# EAGLE design Metro Mini 328 V2 - STEMMA QT (EAGLE 9.6.2)
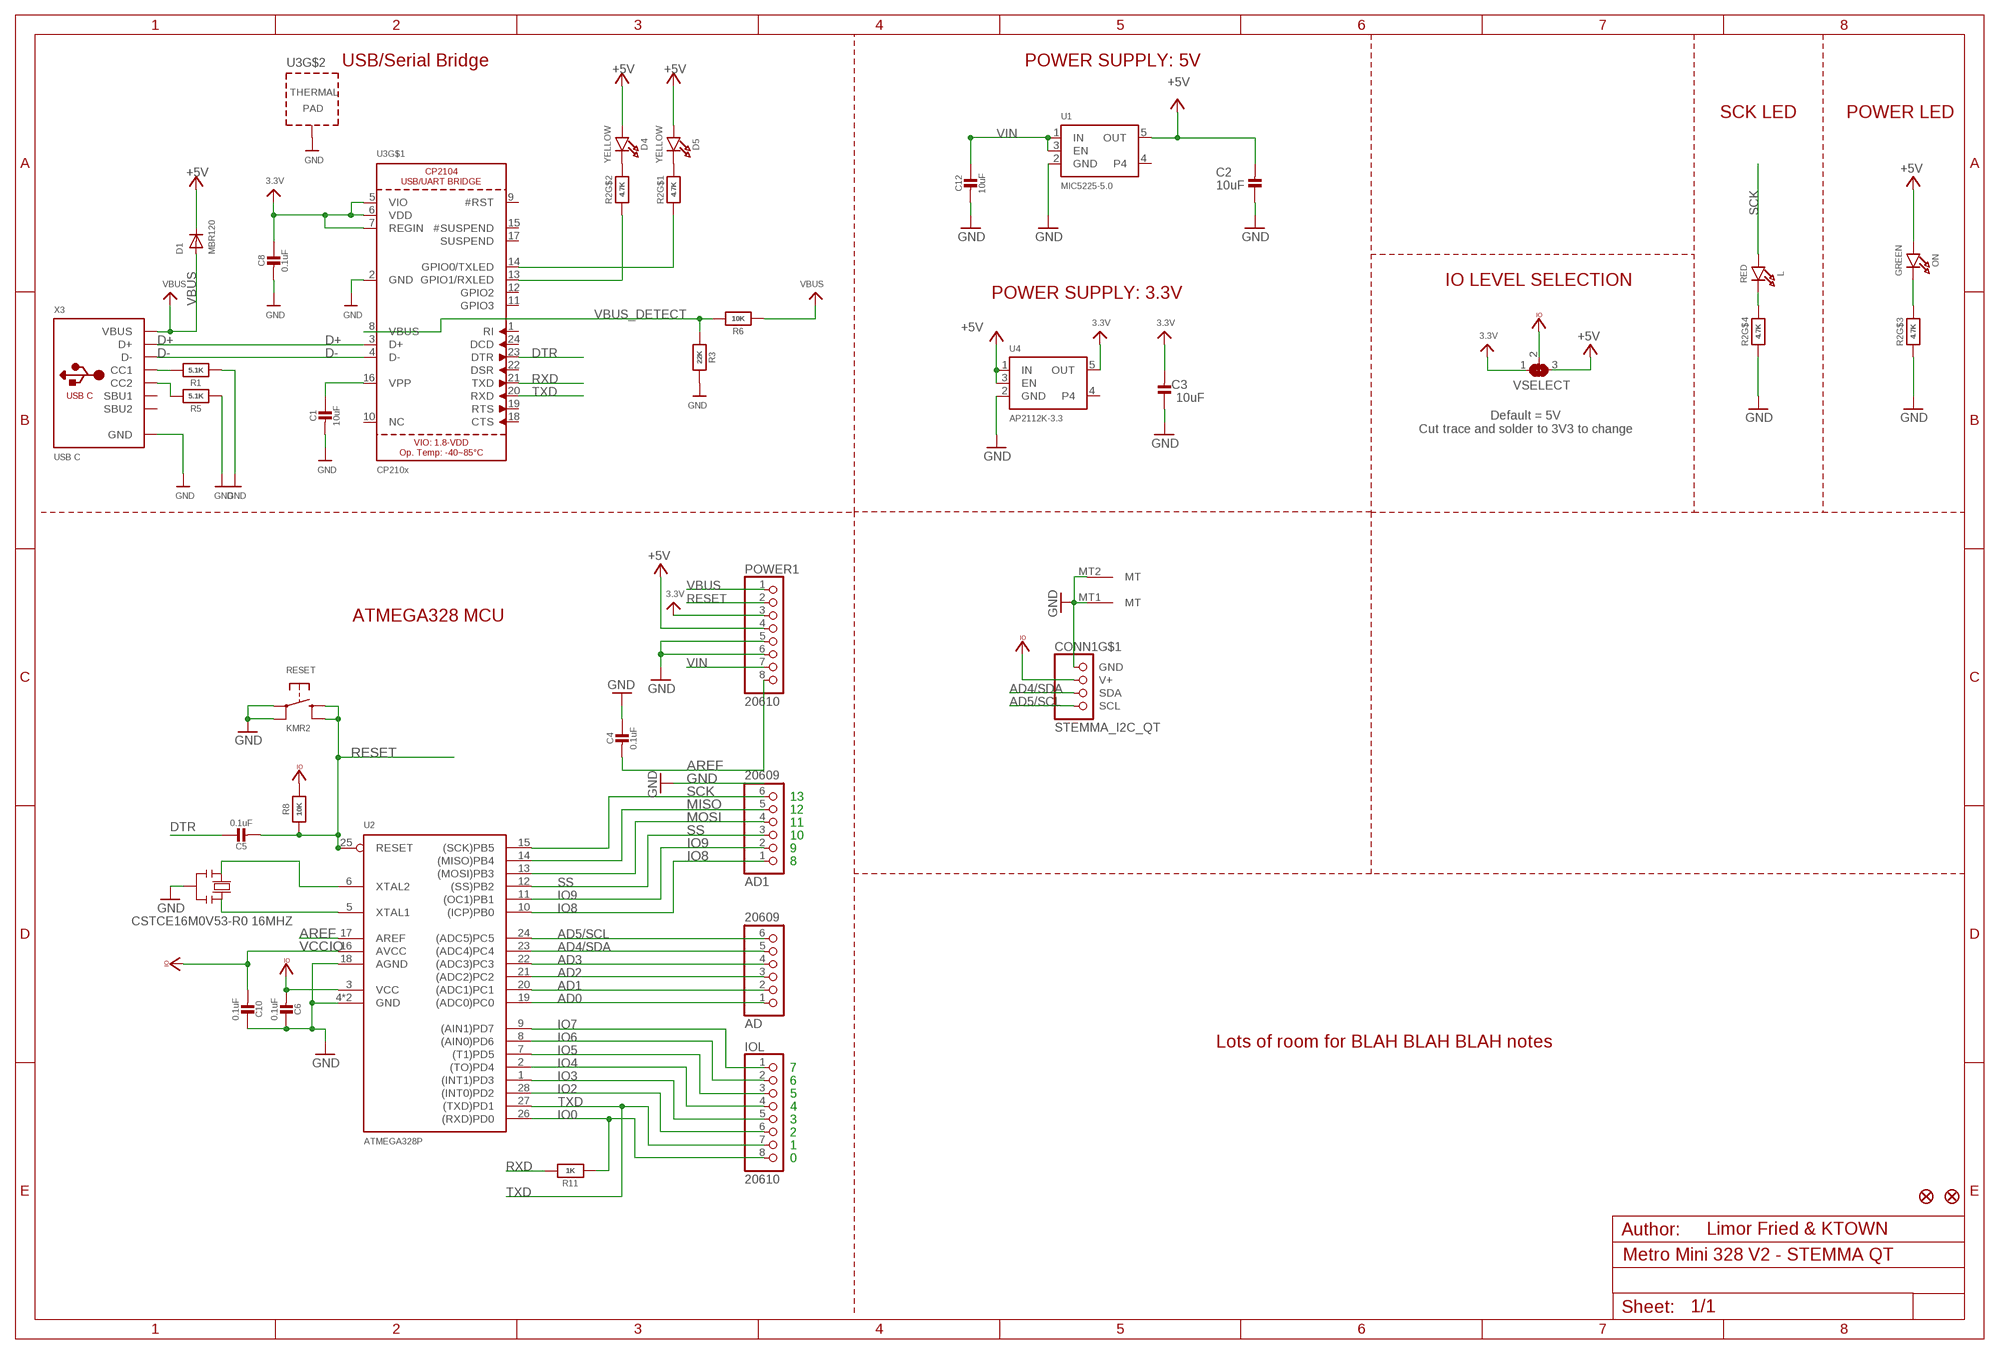
[diagram p0: schematic, sheet 1]

## Parts
AD  20609  HEADER-1X6ROUND  [1X06_ROUND]
AD1  20609  HEADER-1X6ROUND  [1X06_ROUND]
C1  10uF  CAP_CERAMIC0805-NOOUTLINE  [0805-NO]
C2  10uF  CAP_CERAMIC0805-NOOUTLINE  [0805-NO]
C3  10uF  CAP_CERAMIC0805-NOOUTLINE  [0805-NO]
C4  0.1uF  CAP_CERAMIC0603_NO  [0603-NO]
C5  0.1uF  CAP_CERAMIC0603_NO  [0603-NO]
C6  0.1uF  CAP_CERAMIC0603_NO  [0603-NO]
C8  0.1uF  CAP_CERAMIC0603_NO  [0603-NO]
C10  0.1uF  CAP_CERAMIC0603_NO  [0603-NO]
C12  10uF  CAP_CERAMIC0805-NOOUTLINE  [0805-NO]
CONN1  STEMMA_I2C_QT  [JST_SH4]
D1  MBR120  DIODE_MINISOD123  [SOD-123FL]
D4  YELLOW  LED0603_NOOUTLINE  [CHIPLED_0603_NOOUTLINE]
D5  YELLOW  LED0603_NOOUTLINE  [CHIPLED_0603_NOOUTLINE]
FD1  FIDUCIAL_1MM  [FIDUCIAL_1MM]
FD2  FIDUCIAL_1MM  [FIDUCIAL_1MM]
IOL  20610  HEADER-1X8ROUND  [1X08_ROUND]
L  RED  LED0603_NOOUTLINE  [CHIPLED_0603_NOOUTLINE]
ON  GREEN  LED0603_NOOUTLINE  [CHIPLED_0603_NOOUTLINE]
POWER1  20610  HEADER-1X870MIL  [1X08_ROUND_70]
R1  5.1K  RESISTOR_0603_NOOUT  [0603-NO]
R2  4.7K  RESISTOR_4PACK  [RESPACK_4X0603]
R3  22K  RESISTOR_0603_NOOUT  [0603-NO]
R5  5.1K  RESISTOR_0603_NOOUT  [0603-NO]
R6  10K  RESISTOR_0603_NOOUT  [0603-NO]
R8  10K  RESISTOR_0603_NOOUT  [0603-NO]
R11  1K  RESISTOR_0603_NOOUT  [0603-NO]
RESET  KMR2  SWITCH_TACT_SMT4.6X2.8  [BTN_KMR2_4.6X2.8]
U1  MIC5225-5.0  VREG_SOT23-5  [SOT23-5]
U2  ATMEGA328P  ATMEGA328P-MM  [QFN28_4MM_.45MM]
U3  CP210x  CP2104  [QFN24_4MM_SMSC]
U4  AP2112K-3.3  VREG_SOT23-5  [SOT23-5]
VSELECT  SOLDERJUMPER_2WAY  [SOLDERJUMPER_2WAY_OPEN_NOPASTE]
X3  USB C  USB_C  [USB_C_CUSB31-CFM2AX-01-X]
Y2  CSTCE16M0V53-R0 16MHZ  RESONATORMU  [RESONATOR]

## Nets
3.3V [power]: C3.2 C8.1 POWER1.3 U3.5(VIO) U3.6(VDD) U3.7(REGIN) U4.5(OUT) VSELECT.1
+5V [power]: C2.2 D1.C D4.A D5.A ON.A POWER1.4 U1.5(OUT) U4.1(IN) U4.3(EN) VSELECT.3
AD0: AD.1 U2.19((ADC0)PC0)
AD1: AD.2 U2.20((ADC1)PC1)
AD2: AD.3 U2.21((ADC2)PC2)
AD3: AD.4 U2.22((ADC3)PC3)
AD4/SDA: AD.5 CONN1.3(SDA) U2.23((ADC4)PC4)
AD5/SCL: AD.6 CONN1.4(SCL) U2.24((ADC5)PC5)
AREF: C4.2 POWER1.8 U2.17(AREF)
D+: U3.3(D+) X3.A6(D+) X3.B6(D+)
D-: U3.4(D-) X3.A7(D-) X3.B7(D-)
DTR: C5.1 U3.23(DTR)
GND [power]: C1.2 C2.1 C3.1 C4.1 C6.1 C8.2 C10.1 C12.2 CONN1.1(GND) CONN1.MT1(MT) CONN1.MT2(MT) POWER1.5 POWER1.6 R1.1 R2.3 R2.4 R3.1 R5.1 RESET.A'(P1) RESET.A(P) U1.2(GND) U2.4(GND) U2.18(AGND) U2.29(GND) U3.2(GND) U3.THERM(TP) U4.2(GND) X3.A1B12(GND) X3.B1A12(GND) Y2.2
IO0: IOL.8 R11.1 U2.26((RXD)PD0)
IO2: IOL.6 U2.28((INT0)PD2)
IO3: IOL.5 U2.1((INT1)PD3)
IO4: IOL.4 U2.2((TO)PD4)
IO5: IOL.3 U2.7((T1)PD5)
IO6: IOL.2 U2.8((AIN0)PD6)
IO7: IOL.1 U2.9((AIN1)PD7)
IO8: AD1.1 U2.10((ICP)PB0)
IO9: AD1.2 U2.11((OC1)PB1)
MISO: AD1.5 U2.14((MISO)PB4)
MOSI: AD1.4 U2.13((MOSI)PB3)
N$1: L.C R2.5
N$3: ON.C R2.6
N$4: R2.1 U3.14(GPIO0/TXLED)
N$5: R1.2 X3.A5(CC1)
N$6: D4.C R2.7
N$7: D5.C R2.8
N$9: R5.2 X3.B5(CC2)
N$12: C1.1 U3.16(VPP)
N$15: R2.2 U3.13(GPIO1/RXLED)
RESET: C5.2 POWER1.2 R8.1 RESET.B'(S1) RESET.B(S) U2.25(RESET)
RXD: R11.2 U3.21(TXD)
SCK: AD1.6 L.A U2.15((SCK)PB5)
SS: AD1.3 U2.12((SS)PB2)
TXD: IOL.7 U2.27((TXD)PD1) U3.20(RXD)
VBUS [power]: D1.A POWER1.1 R6.2 X3.A4B9(VBUS) X3.B4A9(VBUS)
VBUS_DETECT: R3.2 R6.1 U3.8(VBUS)
VCCIO: C6.2 C10.2 CONN1.2(V+) R8.2 U2.3(VCC) U2.16(AVCC) VSELECT.2
VIN [power]: C12.1 POWER1.7 U1.1(IN) U1.3(EN)
XTAL1: U2.5(XTAL1) Y2.3
XTAL2: U2.6(XTAL2) Y2.1
Unconnected: U1.4 U3.1(RI) U3.9(#RST) U3.10(NC) U3.11(GPIO3) U3.12(GPIO2) U3.15(#SUSPEND) U3.17(SUSPEND) U3.18(CTS) U3.19(RTS) U3.22(DSR) U3.24(DCD) U4.4 X3.A8(SBU1) X3.B8(SBU2)

## Notes on the sheet
- USB/Serial Bridge | POWER SUPPLY: 5V
- SCK LED | POWER LED
- IO LEVEL SELECTION
- POWER SUPPLY: 3.3V
- Default = 5V
  Cut trace and solder to 3V3 to change
- ATMEGA328 MCU
- 13
- 12
- 11
- 10
- 9
- 8
- Lots of room for BLAH BLAH BLAH notes
- 7
- 6
- 5
- 4
- 3
- 2
- 1
- 0
- Limor Fried & KTOWN

## Library data of the parts
AD AD1 = microbuilder:HEADER-1X6: PIN HEADER
C1-C6 C8 C10 C12 = microbuilder:CAP_CERAMIC: Ceramic Capacitors For new designs, use the packages preceded by an '_' character since they are more reliable: The following footprints should be used on most boards: _0402 - Standard footprint for regular board layouts _0603 - Standard footprint for regular board layouts _0805 - Standard footprint for regular board layouts _1206 - Standard footprint for regular board layouts For extremely tight-pitch boards where space is at a premium, the following 'micro-pitch' footprints can be used (smaller pads, no silkscreen outline, etc.): _0402MP - Micro-pitch footprint for very dense/compact boards _0603MP - Micro-pitch footprint for very dense/compact boards _0805MP - Micro-pitch footprint for very dense/compact boards _1206MP - Micro-pitch footprint for very dense/compact boards
CONN1 = microbuilder:STEMMA_I2C
D1 = microbuilder:DIODE: Diode SMA Model Volts Amps Type Vf Ir Digikey # Notes SSA34-E3 40V 3A Schottky 480mV @ 3A 200uA @ 40V SSA34-E3/61TGITR-ND CDBA120-G 20V 1A Schottky 500mV @ 1A 500uA @ 20V 641-1014-6-ND REEL MBRA210 10V 2A Schottky 350mV @ 2A 700uA @ 10V MBRA210LT3 SOD-123 Model Volts Amps Type Vf Ir Order # Notes BAT54T1G 30V 200mA Schottky 800mV @ 200mA 2uA @ 25V BAT54T1GOSTR-ND B0530W 30V 500mA Schottky 430mV @ 500mA 130uA @ 30V B0530W-FDICT-ND REEL MBR120 20V 1A Schottky 340mV @ 1A MBR120VLSFT1GOSCT-ND SOD-323 Model Volts Amps Type Vf Ir Order # Notes PMEG2005EJ 20V 500mA Schottky 355mV @ 500mA 568-4110-1-ND ZLLS410 10V 570mA Schottky 380mV @ 570mA ZLLS410CT-ND 1N4148WS 75V 150mA Silicon/Simple 1V 1N4148WSFSCT-ND REEL SOD-523 Model Volts Amps Type Vf Ir Order # Notes BAT54XV2 30V 200mA Schottky 0.8V @ 100mA BAT54XV2CT-ND TB751S 30V 30mA Schottky RB751S-40TE61CT-ND SOT23-R/W (R = Solder Paste/Reflow Ovens, W = Hand-Soldering) Model Volts Amps Type Vf Ir Order # Notes BAT54FILM 40V 300mA Schottky 497-7162-1-ND POWERDI-5 Model Volts Amps Type Vf Ir Order # Notes PDS560 60V 5A Schottky 670mV @ 5A 150uA @ 60V PDS560DICT-ND
D4 D5 L ON = microbuilder:LED: LED 0603 - 0603 Surface Mount Package 2mA: Green LED - Low Power (3.9mcd, 2ma, 1.7Vf) - Digikey: 475-2709-2-ND Orange LED - Low Power (9.8mcd, 2ma, 1.8Vf) - Digikey: 475-1194-2-ND Red LED - Low Power (5mcd, 2ma, 1.8Vf) - Digikey: 475-1195-2-ND Yellow LED - Low Power (7mcd, 2ma, 1.8Vf) - Digikey: 475-1196-2-ND 5mA: Blue LED - Low Power (17mcd, 5ma, 2.9Vf) - Digikey: LNJ937W8CRACT-ND 0805 - 0805 Surface Mount Package 2mA: Red LED (8.8mcd, 2mA, 1.8Vf, Clear) - Low Power [Digikey: 475-2510-1-ND] Green LED (5mcd, 2mA, 1.8Vf, Clear) - Low Power [Digikey: 475-2730-1-ND] Yellow LED (11.3mcd, 2mA, 1.8Vf, Clear) - Low Power [Digikey: 475-2555-1-ND] 20mA: Red LED (104mcd, 20mA, Diffused) - LS R976 [Digikey: 475-1278-6-ND] Red LED (12mcd, 20mA, 2.0Vf, Clear) - APT2012EC [Digikey: 754-1128-1-ND] Green LED (15mcd, 20mA, 2.2Vf, Clear) - APT2012GC [Digikey: 754-1131-1-ND] Orange LED (160mcd, 20mA, 2.1Vf, Clear) - APT2012SECK [Digikey: 754-1130-1-ND] 1206 - 1206 Surface Mount Package Green LED (26mcd, 20mA, Diffused) - LG N971 [Digikey: 475-1407-6-ND] Red LED (15mcd, 20mA, Diffused) - LH N974 [Digikey: 475-1416-6-ND] Cree - Cree High-Power Surface Mount LEDs XPEBWT-L1-0000-00D50 - White 111lm 350mA 2.9Vf 6200K 110° XTEAWT-00-0000-00000LEE3 - White 114lm 350mA 2.85Vf 5000K 115° Everlight - Everlight 45-21 Series Surface Mount LEDs 45-21/QK2C-B2832AC2CB2/2T - Warm White 2000mcd 20mA 3.25Vf 3050K 120° 45-21/LK2C-B38452C4CB2/2T - Nuetral White 2000mcd 20mA 3.25Vf 4150K 120° 45-21/LK2C-B50634C6CB2/2T - Cold White 2200mcd 20mA 3.25Vf 5650K 120° PLCC2 Reverse Mount LS T77K-J1L2-1-0-2-R18-Z - Red 11.25mcd 2mA 1.8Vf 630nm 120° LO T77K-L1M2-24-Z - Orange 19.6mcd 2mA 1.8Vf 606nm 120° LY T77K-K2M1-26-Z - Yellow 15.7mcd 2mA 1.8Vf 587nm 120°
FD1 FD2 = microbuilder:FIDUCIAL: Fiducial Alignment Points Various fiducial points for machine vision alignment.; BOM: EXCLUDE
IOL POWER1 = microbuilder:HEADER-1X8: PIN HEADER
R1 R3 R5 R6 R8 R11 = microbuilder:RESISTOR: Resistors For new designs, use the packages preceded by an '_' character since they are more reliable: The following footprints should be used on most boards: _0402 - Standard footprint for regular board layouts _0603 - Standard footprint for regular board layouts _0805 - Standard footprint for regular board layouts _1206 - Standard footprint for regular board layouts For extremely tight-pitch boards where space is at a premium, the following 'micro-pitch' footprints can be used (smaller pads, no silkscreen outline, etc.): _0402MP - Micro-pitch footprint for very dense/compact boards _0603MP - Micro-pitch footprint for very dense/compact boards _0805MP - Micro-pitch footprint for very dense/compact boards _1206MP - Micro-pitch footprint for very dense/compact boards
R2 = microbuilder:RESISTOR_4PACK: Resistor Packs (4 resistors) 4 x 0603 10K 1/16W - Digikey: YC164J-10KCT-ND
RESET = adafruit_electromech:SWITCH_TACT_SMT: SMT Tact Switches 6x6mm - Digikey: P12940SCT-ND KMR2 (4.6x2.8mm) - Digikey: 401-1426-1-ND EVQ-PQHB55 - Light Touch, 160GF (4.5x4.5mm) - Digikey: P8090SCT-ND KMT0 - KMT021 NGJ LHS (etc.) IP68/Waterproof - Digikey: CKN10289CT-ND
U1 U4 = adafruit_power:VREG_SOT23-5: SOT23-5 Fixed Voltage Regulators Part Current Out V Out V In V Dropout θJA (°C/W) TJ (°C) Digikey Part No. ADP121 150mA 3.3V 3.4-5.5V 0.09V @ 150mA -- -- ADP121-AUJZ33R7CT-ND ADP121 150mA 3.0V 3.1-5.5V 0.09V @ 150mA -- -- ADP121-AUJZ30R7CT-ND ADP122 300mA 3.3V 3.4-5.5V 0.085V @ 300mA -- -- ADP122AUJZ-3.3-R7CT-ND ADP1712 300mA 3.3V 3.5-5.5V 0.17V @ 300mA -- -- ADP1712AUJZ-3.3-R7TR-ND AP7311 (Low Cost) 150mA 3.3V 3.5-6V 0.15V @ 150mA -- -- AP7311-33WG-7DICT-ND LD39015M18R 150mA 1.8V 1.9V-5.5V 0.08V @ 100mA -- -- 497-6977-1-ND LP2985A-33DBVR 150mA 3.3V 3.3-16V 0.28V @ 150mA 206 150 296-18479-1-ND MCP1824T-3302E/OT 300mA 3.3V 3.5V-6V 0.2V @ 300mA -- -- MCP1824T-3302E/OTCT-ND MIC5205-2.5YM5 TR 150mA 2.5V 2.7-16V 0.165V @ 150mA -- -- 576-1257-2-ND MIC5205-3.0YM5 TR 150mA 3.0V 3.2V-16V 0.165V @ 150mA -- -- 576-1258-2-ND MIC5205-3.3YM5 TR 150mA 3.3V 3.5V-16V 0.165V @ 150mA -- -- 576-1259-2-ND TPS780330220 150mA 3.3V+2.2V 3.6-5.5V 250mV Max -- -- 296-23332-1-ND TDA3663/N1,135 100mA 3.3V 3.5-45V 0.18V @ 50mA -- -- 568-5343-1-ND Max operating temp can be calculated using θJA, TJ (max junction temperature), and power in watts. Set the "Maximum Ambient Temperature" until it reaches TJ ("Max Junction Temperature"), which is the absolute limit for safe use of the regulator: Heat Sink Temperature Calculator <http://www.daycounter.com/Calculators/Heat-Sink-Temperature-Calculator.phtml> For example, With 12V source into a 3.3V LP2985 and a 30mA load, we are dissipating (12V-3.3V) * 0.03A = 0.261W. With a θJA of 206 °C/W, a TJ of 150°C, and 261mW we can safely use the chip without a heat sink up to 75°C (=147.1°C Junction Temperature).
U2 = adafruit_micro:ATMEGA328P: ATMEGA 328P
U3 = microbuilder:CP2104: CP2104 - USB to UART Bridge VDD Output: 3.45V
VSELECT = microbuilder:SOLDERJUMPER_2WAY: 2-Way Solder Jumper
X3 = adafruit_connector:USB_C: USB Type-C USB 2.0 Connector
Y2 = SmartPrj:RESONATOR

## Net classes
1 power: width 0.305 mm, drill 0.483 mm, clearance 0.203 mm

## Board
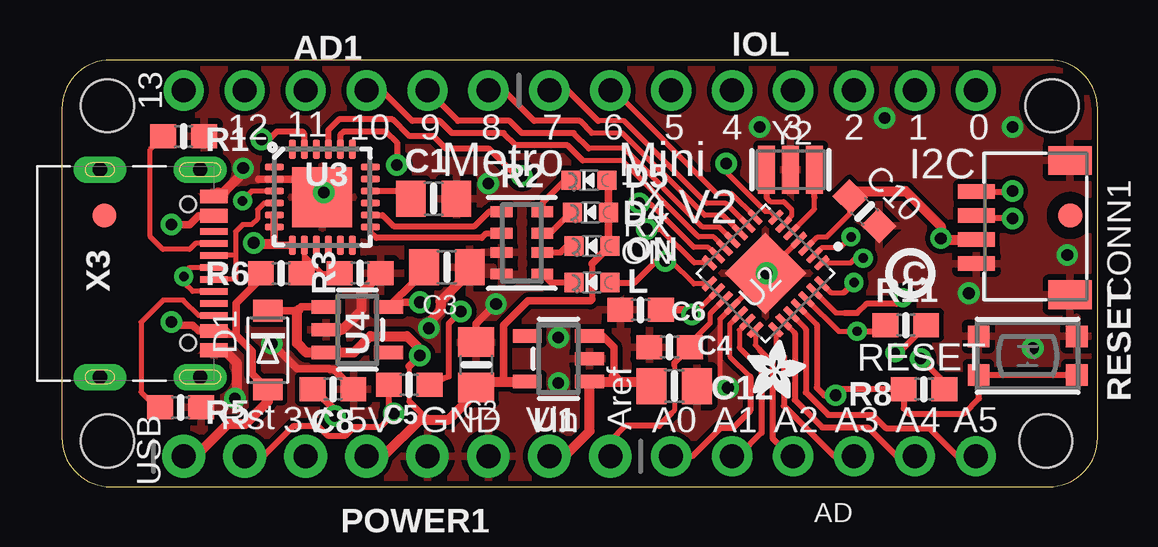
[diagram p1: board, top side]
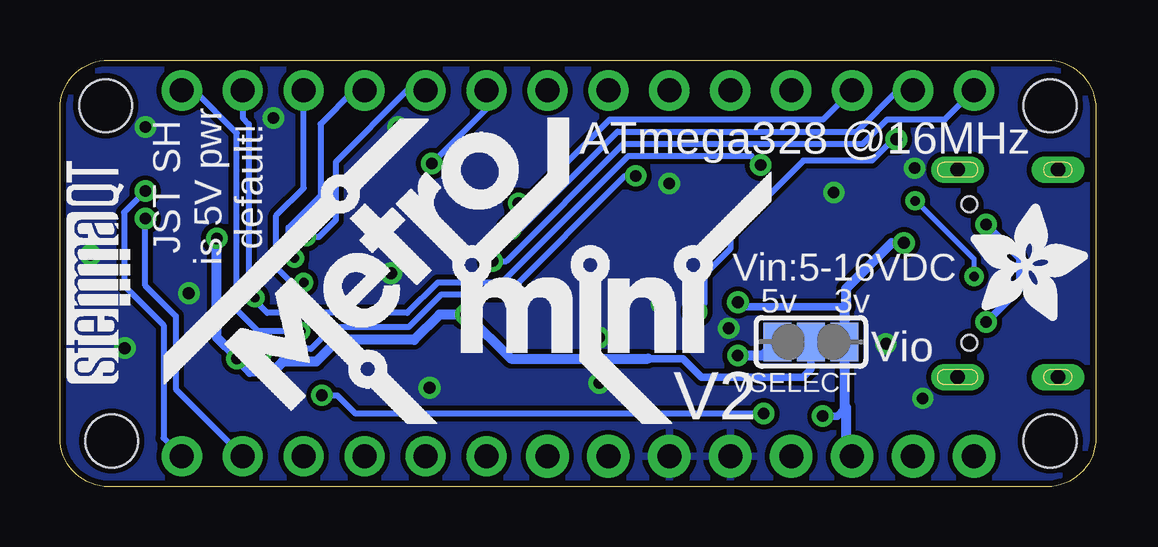
[diagram p2: board, bottom side, seen from below]

Size 43.18 x 17.78 mm. Coordinates in mm from the lower left corner, seen from the top.
Outline: 0,15.75 0,2.03 arc90 2.03,0 41.15,0 arc90 43.18,2.03 43.18,15.75 arc90 41.15,17.78 2.03,17.78 arc90 0,15.75
Copper layers (1*16): Top 0.035mm / dielectric 1.5mm / Bottom 0.035mm
Design rules "adafruit 88": minimum track width 8mil, minimum drill 15.5mil, track to track 8mil, track to pad 8mil, pad to pad 8mil, via to via 8mil, smd to smd 8mil, copper to edge 10mil, drill to drill 8mil, minimum pad ring 10mil, minimum via ring 8mil, stop-mask expansion 2mil, vias tented up to drill 20mil, thermal gap 10mil
Holes 2.2 mm at 1.91,15.88 1.91,1.91 41.27,15.88 41.02,1.91

### Footprints (pad centres in the part's own frame; a part is rotated, then mirrored left to right if it is on the bottom)
1X06_ROUND = drill 1 pad 1.676: 1 -6.35,0; 2 -3.81,0; 3 -1.27,0; 4 1.27,0; 5 3.81,0; 6 6.35,0
0805-NO = smd 1.24 x 1.5: 1 -0.95,0; 2 0.95,0
0603-NO = smd 1.075 x 1: 1 -0.85,0; 2 0.85,0
JST_SH4 = smd 0.6 x 1.55: 1 -1.5,2.514; 2 -0.5,2.514; 3 0.5,2.514; 4 1.5,2.514 | smd 1.2 x 1.8: MT1 -2.8,-1.386; MT2 2.8,-1.386
SOD-123FL = smd 0.91 x 1.22: A 1.637,0; C -1.637,0
CHIPLED_0603_NOOUTLINE = smd 0.8 x 0.8: A 0,-0.75; C 0,0.75
FIDUCIAL_1MM = smd 1 x 1: 1 0,0
1X08_ROUND = drill 1 pad 1.676: 1 -8.89,0; 2 -6.35,0; 3 -3.81,0; 4 -1.27,0; 5 1.27,0; 6 3.81,0; 7 6.35,0; 8 8.89,0
1X08_ROUND_70 = drill 1 pad 1.778: 1 -8.89,0; 2 -6.35,0; 3 -3.81,0; 4 -1.27,0; 5 1.27,0; 6 3.81,0; 7 6.35,0; 8 8.89,0
RESPACK_4X0603 = smd 0.45 x 0.9: 1 -1.3,-0.85; 2 -0.4,-0.85; 3 0.4,-0.85; 4 1.3,-0.85; 5 1.3,0.85; 6 0.4,0.85; 7 -0.4,0.85; 8 -1.3,0.85
BTN_KMR2_4.6X2.8 = smd 0.9 x 0.9: A 2.05,0.8; A' -2.05,0.8; B 2.05,-0.8; B' -2.05,-0.8
SOT23-5 = smd 0.55 x 1.2: 1 -0.95,-1.3; 2 0,-1.3; 3 0.95,-1.3; 4 0.95,1.3; 5 -0.95,1.3
QFN28_4MM_.45MM = smd 0.7 x 0.24: 1 -1.965,1.35; 7 -1.965,-1.35; 15 1.965,-1.35 | smd 0.77 x 0.24: 2 -1.965,0.9; 3 -1.965,0.45; 4 -1.965,0; 5 -1.965,-0.45; 6 -1.965,-0.9; 16 1.965,-0.9; 17 1.965,-0.45; 18 1.965,0; 19 1.965,0.45; 20 1.965,0.9; 21 1.965,1.35 | smd 0.24 x 0.7: 8 -1.35,-1.965; 14 1.35,-1.965; 22 1.35,1.965; 28 -1.35,1.965 | smd 0.24 x 0.77: 9 -0.9,-1.965; 10 -0.45,-1.965; 11 0,-1.965; 12 0.45,-1.965; 13 0.9,-1.965; 23 0.9,1.965; 24 0.45,1.965; 25 0,1.965; 26 -0.45,1.965; 27 -0.9,1.965 | smd 2.4 x 2.4: 29 0,0
QFN24_4MM_SMSC = smd 0.8 x 0.28: 1 -2,1.25; 2 -2,0.75; 3 -2,0.25; 4 -2,-0.25; 5 -2,-0.75; 6 -2,-1.25; 13 2,-1.25; 14 2,-0.75; 15 2,-0.25; 16 2,0.25; 17 2,0.75; 18 2,1.25 | smd 0.28 x 0.8: 7 -1.25,-2; 8 -0.75,-2; 9 -0.25,-2; 10 0.25,-2; 11 0.75,-2; 12 1.25,-2; 19 1.25,2; 20 0.75,2; 21 0.25,2; 22 -0.25,2; 23 -0.75,2; 24 -1.25,2 | smd 2.5 x 2.5: THERM 0,0
SOLDERJUMPER_2WAY_OPEN_NOPASTE = smd 1.168 x 1.6: 1 -1.397,0; 2 0,0; 3 1.397,0
USB_C_CUSB31-CFM2AX-01-X = smd 0.575 x 1.15: A1B12 -3.2,3.545; A4B9 -2.4,3.545; B1A12 3.2,3.545; B4A9 2.4,3.545 | smd 0.275 x 1.15: A5 -1.25,3.545; A6 -0.25,3.545; A7 0.25,3.545; A8 1.25,3.545; B5 1.75,3.545; B6 0.75,3.545; B7 -0.75,3.545; B8 -1.75,3.545 | drill 0.6 pad 1 long: M1 -4.32,2.97; M2 4.32,2.97; M3 -4.32,-1.21; M4 4.32,-1.21 | hole 0.65: 2.89,2.47; -2.89,2.47
RESONATOR = smd 0.7 x 2: 1 -1,0; 2 0,0; 3 1,0

### Placement (x,y rotation side)
AD  31.75,1.27 0 top
AD1  11.43,16.51 180 top
C1  15.49,12 0 top
C2  17.27,5.08 270 top
C3  16.05,9.14 180 top
C4  25.34,5.82 0 top
C5  14.48,4.25 180 top
C6  24.13,7.37 0 top
C8  11.3,4.06 0 top
C10  33.46,11.48 135 top
C12  25.53,4.19 0 top
CONN1  40.64,10.79 90 top
D1  8.59,5.69 270 top
D4  22.03,11.43 90 top
D5  21.97,12.76 90 top
FD1  1.78,11.3 0 top
FD2  42.04,11.3 0 top
IOL  29.21,16.51 0 top
L  22.1,8.51 90 top
ON  22.1,10.03 90 top
POWER1  13.97,1.27 0 top
R1  5.08,14.61 180 top
R2  19.18,10.16 270 top
R3  12.43,8.9 180 top
R5  4.95,3.3 180 top
R6  9.14,8.89 180 top
R8  35.94,4.06 0 top
R11  35.18,6.73 0 top
RESET  40.26,5.46 0 top
U1  20.7,5.33 90 top
U2  29.34,8.89 225 top
U3  10.86,12.06 0 top
U4  12.32,6.54 270 top
U$4  [PCBFEAT-REV-040]  35.37,8.89 0 top
U$5  [ADAFRUIT_2.5MM]  28.57,3.68 0 top
U$6  [STEMMAQT]  40.26,4.32 90 bottom
U$7  [METROMINI_SILK]  38.86,2.6 0 bottom
U$10  [ADAFRUIT_5MM]  5.21,6.92 0 bottom
VSELECT  11.87,6.03 180 bottom
X3  2.79,8.89 270 top
Y2  30.37,13.21 0 top

### Tracks (layer width: path | path; a pad name or v marks a point on that pad's centre or on a via)
3.3V  (via drill 0.48, 0.5)
  Top 0.305: U3.5 U3.6 8.86,10.16 v8,10.16 8.1,10.06 U3.7 | v14.92,7.68 13.81,7.68 U4.5 14.7,8.57 14.7,8.73 C3.2 | C8.1 10.52,4.06 11.39,3.19 v11.39,2.94
  Bottom 0.305: v14.92,7.68 14.73,7.49 10.48,7.49 10.41,7.49 | 8.51,10.16 v8,10.16 | v11.39,2.94 10.78,2.94 10.48,3.24 10.41,3.3
  Bottom 0.406: 10.48,3.24 VSELECT.1 10.48,7.49 | 10.41,3.3 10.41,1.52 POWER1.3 | 10.41,7.49 10.41,8.26 8.51,10.16
+5V  (via drill 0.48)
  Top 0.203: 14.48,5.02 14.48,3.56
  Top 0.254: 22.1,9.28 22.1,7.81 | 15.24,2.79 14.48,3.56
  Top 0.305: D5.A 22.79,12.7 D4.A 22.79,10.1 ON.A 22.1,9.28 | 18.41,4.38 18.41,6.73 19.43,7.75 22.04,7.75 22.1,7.81 | v14.92,5.46 14.48,5.02 | U4.1 9.98,7.49 9.85,7.36 9.82,7.33 D1.C
  Top 0.406: POWER1.4 13.4,1.27 14.92,2.79 15.24,2.79 16.13,2.79 17.27,3.94 C2.2 17.53,4.38 18.41,4.38 U1.5 | v14.92,5.46 14.92,5.74 14.39,6.27 12.85,6.27 12.17,5.59 U4.3 10.18,5.59 9.8,5.97 9.8,7.31 9.85,7.36
  Bottom 0.406: VSELECT.3 13.34,6.03 13.91,5.46 v14.92,5.46
AD0
  Top 0.203: U2.19 27.84,6.75 27.84,5.45 28.7,4.58
  Top 0.254: AD.1 26.29,1.27 27.46,2.44 27.96,2.44 28.7,3.17 28.7,4.58
AD1
  Top 0.203: U2.20 28.25,6.53 28.25,5.79 29.17,4.87
  Top 0.254: AD.2 28.19,1.27 29.17,2.24 29.17,4.87
AD2
  Top 0.203: U2.21 28.9,5.9 29.08,5.71
  Top 0.254: 29.08,5.71 29.62,5.17 29.62,2.02 30.38,1.27 AD.3
AD3
  Top 0.203: U2.22 29.77,5.78 30.1,5.46
  Top 0.254: AD.4 32.19,1.27 30.1,3.37 30.1,5.46
AD4/SDA  (via drill 0.48)
  Top 0.203: U2.23 30.56,6.4
  Top 0.254: 30.56,6.4 30.56,3.62 31.7,2.48 33.59,2.48 34.8,1.27 AD.5 | v39.62,11.18 38.24,11.18 CONN1.3
  Bottom 0.254: AD.5 38.35,4.06 38.35,7.11 39.62,8.38 v39.62,11.18
AD5/SCL  (via drill 0.48)
  Top 0.203: U2.24 31.01,6.58
  Top 0.254: AD.6 37.34,1.27 36.17,2.44 34.34,2.44 33.78,3 31.95,3 31.01,3.94 31.01,6.58 | CONN1.4 39.6,12.29 v39.62,12.32
  Bottom 0.254: v39.62,12.32 40.51,11.43 40.51,8.38 38.86,6.73 38.86,2.03 AD.6
AREF
  Top 0.203: 25.4,3.05 25.53,3.17 25.53,5.08 | U2.17 27.03,7.21 27.03,6.81 26.19,5.97 C4.2
  Top 0.254: POWER1.8 22.86,1.91 23.5,2.54 24.89,2.54 25.4,3.05 | 25.53,5.08 25.53,5.16 C4.2
D+  (via drill 0.39)
  Top 0.203: X3.B6 5.45,8.14 5.08,8.51 v5.08,8.76 5.08,8.89 5.33,9.14 X3.A6 | U3.3 7.91,12.31 7.53,11.94 v7.53,11.91
  Bottom 0.203: v7.53,11.91 7.49,11.91 5.08,9.5 v5.08,8.76
D-
  Top 0.203: X3.A7 7.24,8.64 7.25,8.65 7.25,9.64 7.24,9.64 | U3.4 8.42,11.81 8.15,11.54 8.15,11.15 7.92,10.92 7.53,10.92 7.24,10.63 7.24,9.64 | 7.24,9.64 X3.B7
DTR  (via drill 0.48, 0.5)
  Top 0.254: v16.64,7.3 16.13,6.79 16.13,4.6 C5.1 | U3.23 10.1,14.08 10.1,14.73 10.03,14.8 8.95,14.8 8.64,14.48 v8.32,14.48
  Bottom 0.254: v8.32,14.48 8.45,14.48 9.34,13.59 12.19,13.59 15.24,10.54 15.24,9.91 16.32,8.83 16.32,7.62 v16.64,7.3
GND  (via drill 0.48, 0.5)
  Top 0.203: U2.4 U2.29 U2.18 27.43,6.99 27.43,4.47
  Top 0.305: U3.THERM 10.11,12.81 U3.2 8.2,12.81 | C8.2 11.33,4.89 11.17,4.89 11.14,4.92 9.81,4.92 8.78,5.96 v8.75,5.96 | C2.1 17.27,6.79 v18.1,7.62 | 27.43,4.47 v27.77,4.12
  Top 0.406: C6.1 23.25,7.34 22.95,7.33 | X3.A1B12 6.5,12.25 6.72,12.25 7.56,13.09 v7.56,13.27 | X3.B1A12 6.76,5.69 7.29,5.16 7.29,3.76 v7.21,3.68 | U4.2 11.68,6.54 12.47,7.33 12.47,8.09 R3.1 | C3.1 17,8.94 15.78,7.72 15.78,7.33 15.3,6.85 v15.3,6.6
  other vias: 29.38,8.89 39.62,14.99 41.91,9.65 20.7,6.22 10.92,12.26 34.29,15.37 17.78,12.64 20.7,4.32 40.47,5.78 37.81,8.06 29.08,14.99
  pour Top: 0,17.78 0,0 43.18,0 43.18,17.78
  pour Bottom: 0,17.78 0,0 43.18,0 43.18,17.78
IO0  (via drill 0.39)
  Top 0.203: U2.26 32.39,6.48 32.81,6.48
  Top 0.254: 32.81,6.48 v33.15,6.48 34.08,6.48 R11.1
  Bottom 0.254: v33.15,6.48 34.92,6.48 35.81,7.37 35.81,14.73 37.59,16.51 IOL.8
IO2  (via drill 0.39)
  Top 0.203: U2.28 32.05,8.09 32.6,8.09
  Top 0.254: 32.6,8.09 v33.02,8.51
  Bottom 0.254: v33.02,8.51 33.53,8.51 34.16,9.14 34.16,11.3 33.02,12.45 IOL.6
IO3  (via drill 0.39)
  Top 0.203: U2.1 32.88,9.32 33.08,9.53
  Top 0.254: 33.08,9.53 v33.4,9.53
  Bottom 0.254: v33.4,9.53 33.66,9.53 33.66,10.79 32.32,12.13 32.32,15.11 30.92,16.51 IOL.5
IO4  (via drill 0.39)
  Top 0.203: U2.2 31.69,9.97 32.45,9.97 32.64,10.16
  Top 0.254: 32.64,10.16 v32.89,10.41
  Bottom 0.254: v32.89,10.41 32.38,10.41 31.69,11.11 31.69,13.53 28.7,16.51 IOL.4
IO5  (via drill 0.48)
  Top 0.203: U2.7 29.53,11.48 29.32,11.48 27.69,13.12 v27.69,13.46
  Bottom 0.254: v27.69,13.46 25.4,15.75 IOL.3
IO6
  Top 0.203: U2.8 27.92,12.22 27.3,12.22 23.01,16.51
  Top 0.254: 23.01,16.51 IOL.2
IO7
  Top 0.203: 22.35,15.24 23.44,15.24 26.87,11.81 27.69,11.81 U2.9
  Top 0.254: 22.35,15.24 21.08,16.51 IOL.1
IO8
  Top 0.203: 22.1,14.73 23.37,14.73 26.8,11.3 27.56,11.3 U2.10
  Top 0.254: 22.1,14.73 21.59,15.24 19.68,15.24 18.41,16.51 AD1.1
IO9
  Top 0.203: 21.97,14.1 23.43,14.1 26.71,10.82 27.41,10.82 U2.11
  Top 0.254: 21.97,14.1 21.34,14.73 19.18,14.73 18.67,15.24 16.51,15.24 AD1.2
MISO  (via drill 0.48)
  Top 0.203: U2.14 26.36,9.32 24.96,10.73
  Top 0.254: 24.96,10.73 v24.38,10.73
  Bottom 0.254: v24.38,10.73 24,10.73 19.94,14.8 9.97,14.8 8.26,16.51 AD1.5
MOSI  (via drill 0.48)
  Top 0.203: U2.13 27.28,9.64 26.94,9.97 26.35,9.97 24.57,11.75
  Top 0.254: v24.07,11.81 24.13,11.75 24.57,11.75
  Bottom 0.254: v24.07,11.81 23.94,11.68 23.88,11.68 20.26,15.3 11.37,15.3 AD1.4
N$1
  Top 0.254: L.C 20.38,8.51 R2.5
N$2
  Bottom 0.254: 12.12,6.04 13.01,6.04
N$3
  Top 0.254: ON.C 21.06,10.03 20.79,9.76 R2.6
N$4
  Top 0.254: U3.14 13.37,11.31 13.82,10.86 17.21,10.86 17.81,11.46 R2.1
N$5
  Top 0.203: X3.A5 5.58,10.14 5.32,9.89 4.21,9.89 3.68,10.41 3.68,14.06 R1.2
N$6
  Top 0.254: D4.C 21.22,11.43 20.33,10.54 20.33,10.56 R2.7
N$7
  Top 0.254: D5.C 20.97,12.76 20.03,11.82 R2.8
N$9
  Top 0.203: R5.2 3.94,3.3 3.3,3.94 3.3,6.86 4.22,7.78 5.06,7.78 5.7,7.14 X3.B5
N$12
  Top 0.254: C1.1 14.23,12.31 U3.16
N$15
  Top 0.254: U3.13 12.86,10.62 13.11,10.37 17.5,10.37 17.69,10.56 R2.2
RESET  (via drill 0.48)
  Top 0.203: U2.25 31.47,6.76
  Top 0.254: POWER1.2 8.38,1.27 9.65,2.54 10.67,2.54 11.08,2.13 11.84,2.13 12.2,2.49 13.28,2.49 v13.84,3.05 13.63,3.26 C5.2 | 31.47,6.76 31.47,4.12 31.79,3.81 v32.26,3.81 32.51,4.06 R8.1 35.09,3.26 35.31,3.05 37.59,3.05 38.23,3.68 38.23,4.64 RESET.B' RESET.B
  Bottom 0.254: v32.26,3.81 31.62,3.81 30.86,3.05 v13.84,3.05
RXD  (via drill 0.39, 0.48)
  Top 0.254: U3.21 11.11,14.86 11.56,15.3 13.78,15.3 14.48,14.61 15.49,14.61 16,14.1 17.78,14.1 18.92,12.95 v19.18,12.95 | R11.2 34.82,5.52 34.8,5.52 v34.73,5.59
  Bottom 0.254: v19.18,12.95 19.62,12.95 24.57,8 27.29,8 28.64,6.66 28.96,6.66 | 28.96,6.66 | 28.96,6.66 31.81,6.66 32.72,5.75 34.58,5.75 v34.73,5.59
SCK  (via drill 0.48)
  Top 0.203: v25.15,9.4 25.4,9.4 26.34,8.46 U2.15
  Top 0.254: L.A 23.88,8.51 24.77,9.4 v25.15,9.4
  Bottom 0.254: v25.15,9.4 24.57,9.4 19.68,14.29 9.72,14.29 8.7,15.3 6.29,15.3 AD1.6
SS
  Top 0.203: 21.72,13.59 23.37,13.59 26.54,10.41 27.18,10.41 U2.12
  Top 0.254: 21.72,13.59 21.08,14.22 18.92,14.22 18.41,14.73 16.26,14.73 15.75,15.24 14.61,15.24 13.34,16.51 AD1.3
TXD  (via drill 0.39, 0.48)
  Top 0.203: U2.27 32.26,7.24 32.63,7.24
  Top 0.254: 32.63,7.24 33.15,7.24 33.53,7.62 34.8,7.62 v35.05,7.87 | v13.97,13.4 13.97,14.35 13.53,14.8 11.75,14.8 11.61,14.66 U3.20
  Bottom 0.254: v13.97,13.4 14.35,13.78 19.49,13.78 24.77,8.51 27.43,8.51 28.7,7.24 34.54,7.24 35.05,7.75 v35.05,7.87 35.18,7.87 35.31,8 35.31,15.11 35.56,15.37 IOL.7
VBUS  (via drill 0.48)
  Top 0.305: 7.27,6.32 7.23,6.36 6.97,6.36 6.85,6.49 X3.B4A9 5.7,6.49 5.46,6.73 4.7,6.73 v4.57,6.86 | 7.27,6.32 7.94,5.65 7.94,4.7 D1.A | v4.57,10.92 5.33,10.92 5.7,11.29 X3.A4B9 | R6.2 8.29,8.68 7.27,7.65 7.27,6.32
  Top 0.406: POWER1.1 5.59,1.27 6.92,2.6 7.64,2.6 8.59,3.54 D1.A
  Bottom 0.305: v4.57,6.86 3.17,8.26 3.17,9.53 v4.57,10.92
VBUS_DETECT
  Top 0.203: R3.2 10.82,8.9 10.11,9.62 U3.8 10.11,9.01 R6.1
VCCIO  (via drill 0.48)
  Top 0.203: U2.16 26.54,7.37 | U2.3 31.5,10.41 31.9,10.41 32.86,11.38 C10.2
  Top 0.254: 26.3,7.18 v26.26,7.18 | R8.2 36.79,4.34 v35.8,5.33 | 26.54,7.37 26.11,7.37 25.92,7.37
  Top 0.305: C6.2 25.92,7.37 | 26.11,7.37 26.3,7.18
  Top 0.406: C10.2 33.1,12.32 35.18,12.32 36.64,10.86 v36.64,10.35 36.7,10.29 CONN1.2
  Bottom 0.254: v35.8,5.33 35.8,5.38
  Bottom 0.305: 18.67,5.33 17.21,5.33 16.43,4.56 12.21,4.56 11.87,4.89 VSELECT.2
  Bottom 0.406: 18.67,5.33 24.38,5.33 26.23,7.18 v26.26,7.18 27.36,7.18 28.42,6.12 31.59,6.12 32.5,5.21 33.91,5.21 34.34,4.78 35.26,4.78 v35.8,5.32 v35.8,5.33 | v36.64,10.35 36.64,6.22 35.8,5.38
VIN
  Top 0.305: U1.3 22.55,6.28 23.01,5.82 23.01,4.61
  Top 0.406: POWER1.7 20.95,1.27 22,2.32 U1.1 23.24,4.38 | 23.01,4.61 23.24,4.38 | 23.24,4.38 24.38,4.38 C12.1
XTAL1
  Top 0.203: U2.5 31.38,11.56 31.38,12.06
  Top 0.254: 31.38,12.06 Y2.3
XTAL2
  Top 0.203: U2.6 30.09,10.95 30.42,11.28 30.42,11.56 30.1,11.88 29.54,11.88 29.38,12.05
  Top 0.254: Y2.1 29.38,12.05

### Text on the board
tPlace: 13 | 12 | 11 | 10 | 9 | 8 | 7 | 6 | 5 | 4 | 3 | 2 | 1 | 0 | Metro Mini | I2C | TX | V2 | RX | ON | L | RESET | Aref | Rst | 3V | 5V | GND | Vin | A0 | A1 | A2 | A3 | A4 | A5 | USB
bPlace: ATmega328 @16MHz | JST SH / is 5V pwr / default! | Vin:5-16VDC | 3v | 5v | Vio | V2
ReferenceLC: PC1 | PC2
214bmp: D:/SmartProjects/Snc/a4_bn_logo2.bmp